# Altium schematic sheet Frequency_REF_Module.schdoc: Frequency Reference
size 420 x 297 mm; EDA_Number: ARTIQ; Projet: KASLI 3U subsystem; CheckedBy: MK; Author: G.K.; CompanyName: CREOTECH; DrawnBy: G.K.; Organization: CTI SA; Address1: Creotech Instruments SA; Address2: Okulickiego 7/9, 05-500 Poland; Revision: -; SheetNumber: -; SheetTotal: -; ModifiedBy: -; CreateDate: XX/XX/XXXX; CheckedDate: -; Title2: Top; DivGrp: CTI; Designer: G.K.; ModifiedDate: -; ProjectName: FMC DAC 100M 14B 16CHA ADC 2M 14B 4CHA
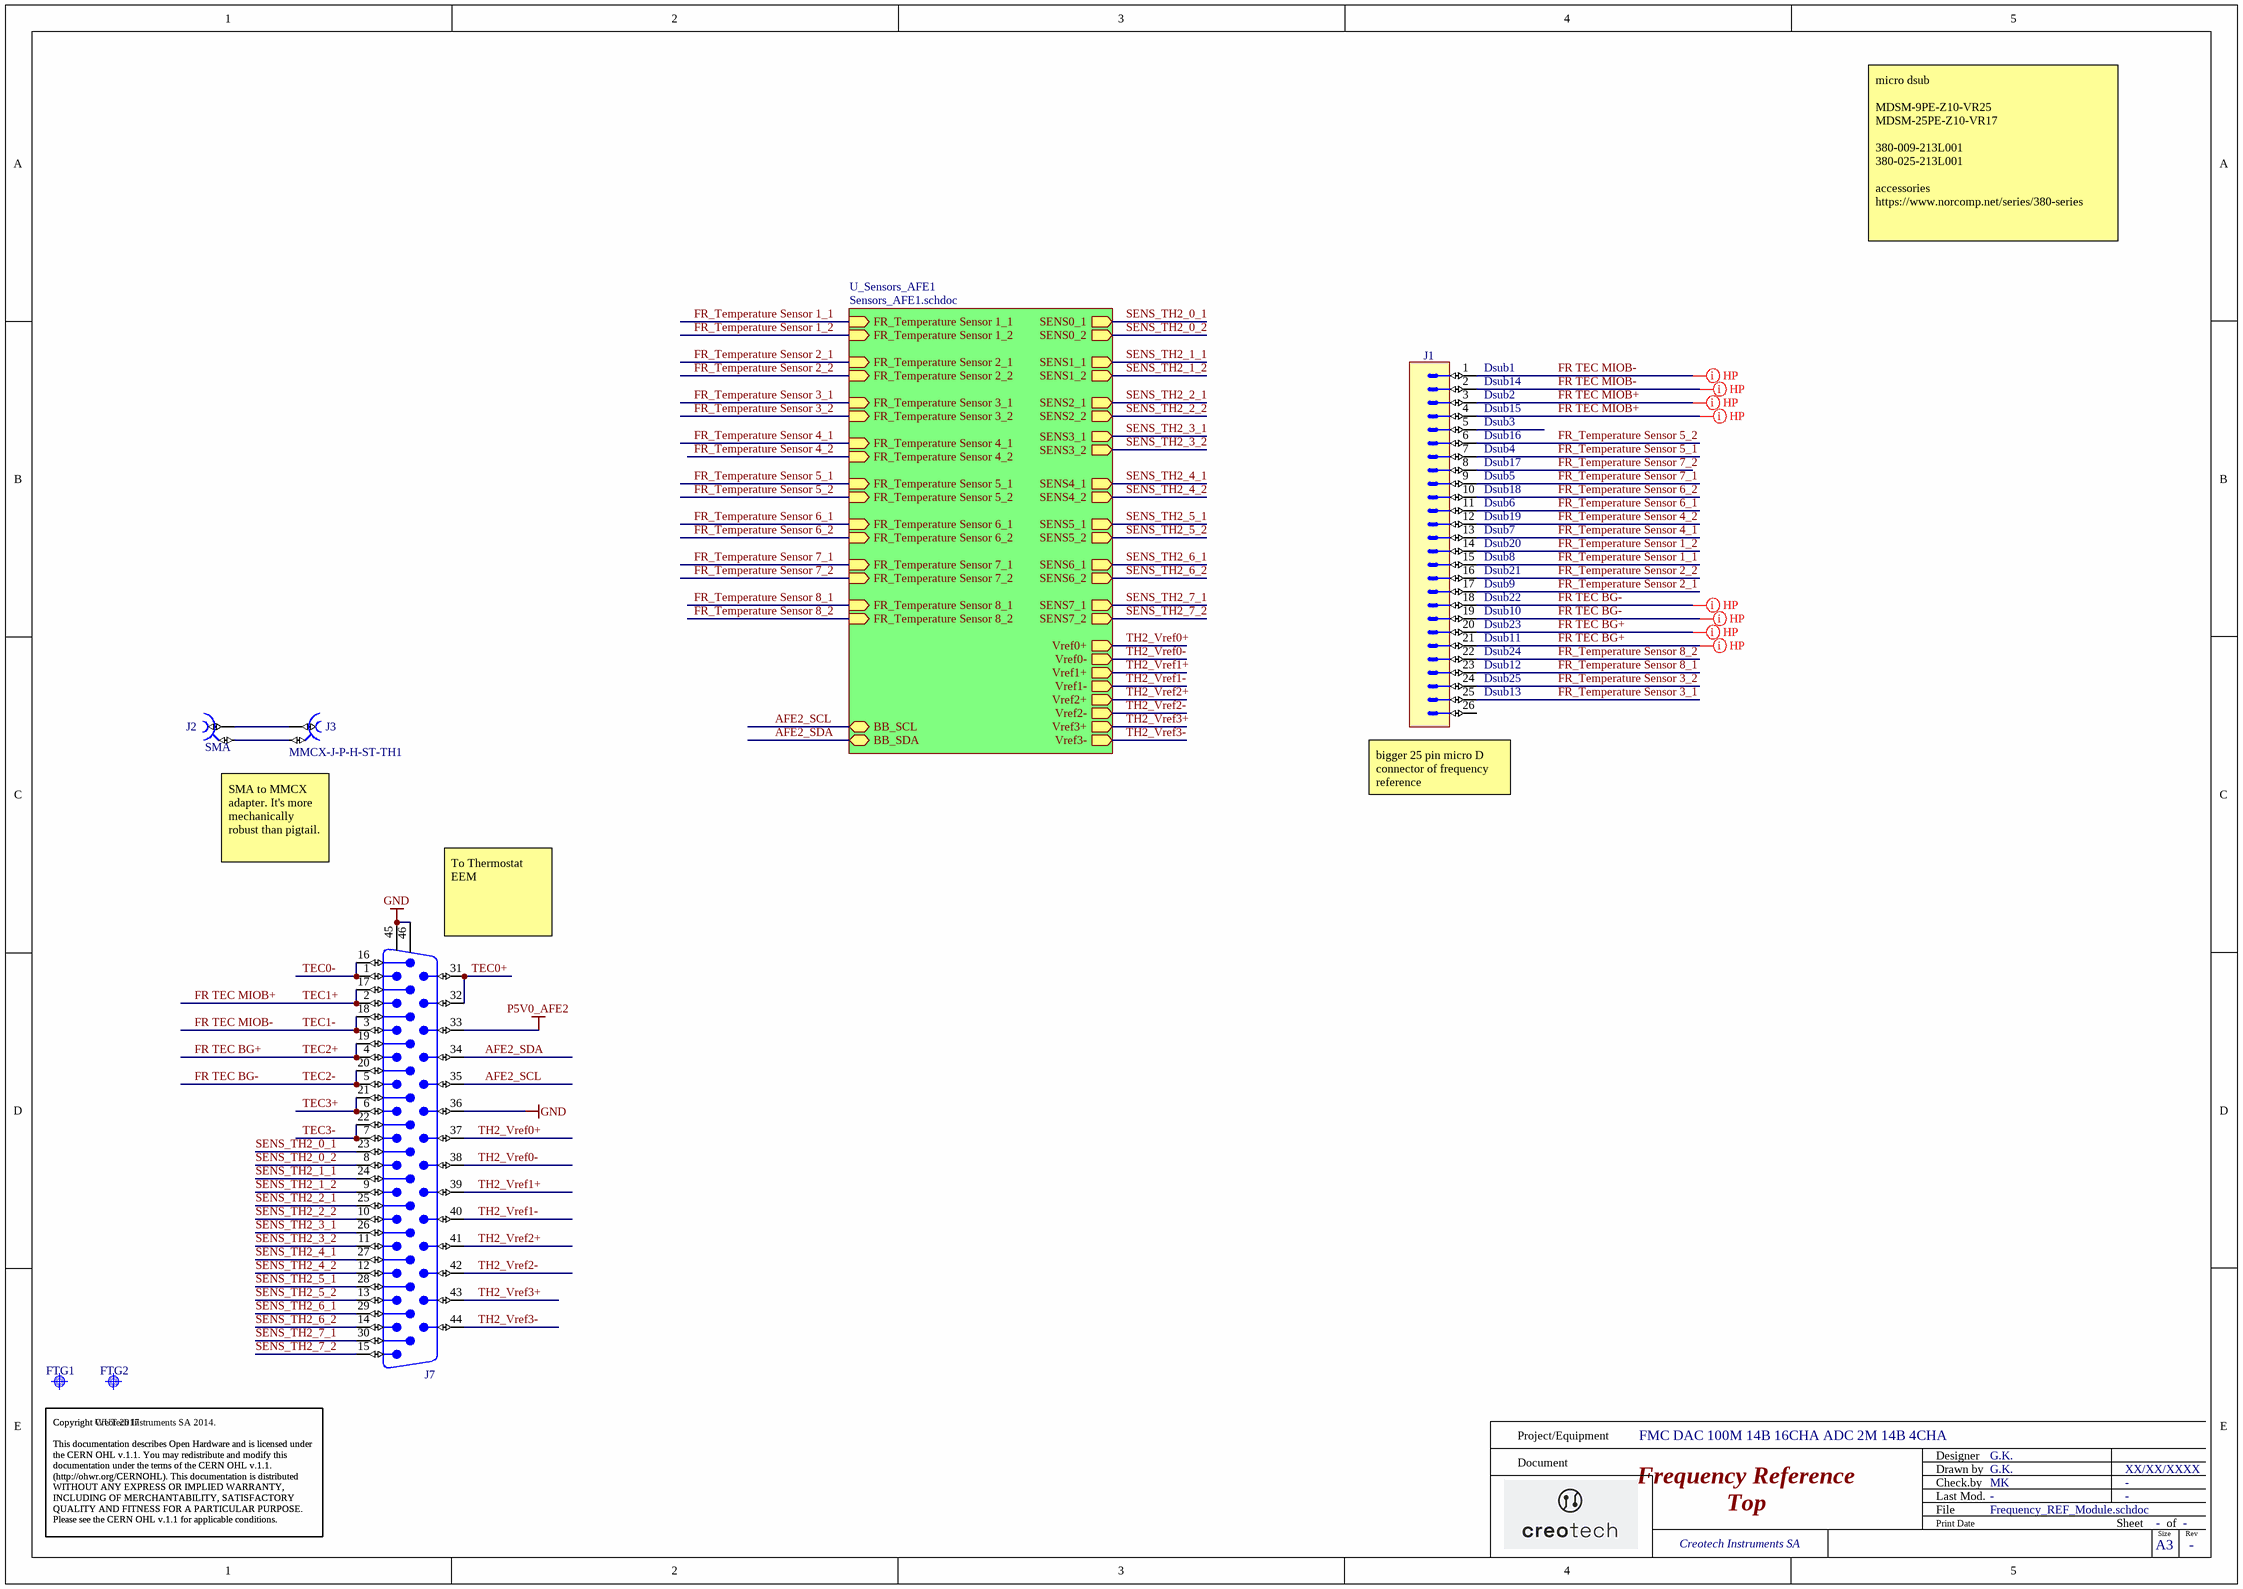
[diagram p0: Frequency_REF_Module.schdoc]

## Parts
FTG1  Use only in PCB  [FIDUCIAL_TOP_C100-200]  (value not drawn)
FTG2  Use only in PCB  [FIDUCIAL_TOP_S100-200]  (value not drawn)
J1  Header 26  [3M_N2526-6002RB]  (value not drawn)
J2  SMA  [DELOCK_65848]
J3  Manufacturer Part Number: MMCX-J-P-H-ST-TH1  [SAMTEC_MMCX-J-P-H-ST-TH1]  (hidden comment: Coax_1Female_1Shield)
J7  D-Sub  [AMPHENOL_10090926-P444XLF]  (value not drawn)

## Sub-sheets
U_Sensors_AFE1 = Sensors_AFE1.schdoc: SENS0_1 (out), SENS0_2 (out), SENS1_1 (out), SENS1_2 (out), SENS2_1 (out), SENS2_2 (out), SENS3_1 (out), SENS3_2 (out), SENS4_1 (out), SENS4_2 (out), SENS5_1 (out), SENS5_2 (out), SENS6_1 (out), SENS6_2 (out), SENS7_1 (out), SENS7_2 (out), Vref0+ (out), Vref0- (out), Vref1+ (out), Vref1- (out), Vref2+ (out), Vref2- (out), Vref3+ (out), Vref3- (out), BB_SCL (bidir), BB_SDA (bidir), FR_Temperature Sensor 1_2 (in), FR_Temperature Sensor 2_2 (in), FR_Temperature Sensor 1_1 (in), FR_Temperature Sensor 2_1 (in), FR_Temperature Sensor 3_1 (in), FR_Temperature Sensor 3_2 (in), FR_Temperature Sensor 4_1 (in), FR_Temperature Sensor 4_2 (in), FR_Temperature Sensor 5_1 (in), FR_Temperature Sensor 5_2 (in), FR_Temperature Sensor 6_1 (in), FR_Temperature Sensor 6_2 (in), FR_Temperature Sensor 7_1 (in), FR_Temperature Sensor 7_2 (in), FR_Temperature Sensor 8_1 (in), FR_Temperature Sensor 8_2 (in)

## Nets
GND: J7.36 J7.45 J7.46
P5V0_AFE2: J7.33
AFE2_SCL: J7.35 ; sheet U_Sensors_AFE1/BB_SCL
AFE2_SDA: J7.34 ; sheet U_Sensors_AFE1/BB_SDA
FR TEC BG+: J1.20 J1.21 J7.4 J7.19  [also labelled TEC2+]
FR TEC BG-: J1.18 J1.19 J7.5 J7.20  [also labelled TEC2-]
FR TEC MIOB+: J1.3 J1.4 J7.2 J7.17  [also labelled TEC1+]
FR TEC MIOB-: J1.1 J1.2 J7.3 J7.18  [also labelled TEC1-]
FR_Temperature Sensor 1_1: J1.15 ; sheet U_Sensors_AFE1/FR_Temperature Sensor 1_1
FR_Temperature Sensor 1_2: J1.14 ; sheet U_Sensors_AFE1/FR_Temperature Sensor 1_2
FR_Temperature Sensor 2_1: J1.17 ; sheet U_Sensors_AFE1/FR_Temperature Sensor 2_1
FR_Temperature Sensor 2_2: J1.16 ; sheet U_Sensors_AFE1/FR_Temperature Sensor 2_2
FR_Temperature Sensor 3_1: J1.25 ; sheet U_Sensors_AFE1/FR_Temperature Sensor 3_1
FR_Temperature Sensor 3_2: J1.24 ; sheet U_Sensors_AFE1/FR_Temperature Sensor 3_2
FR_Temperature Sensor 4_1: J1.13 ; sheet U_Sensors_AFE1/FR_Temperature Sensor 4_1
FR_Temperature Sensor 4_2: J1.12 ; sheet U_Sensors_AFE1/FR_Temperature Sensor 4_2
FR_Temperature Sensor 5_1: J1.7 ; sheet U_Sensors_AFE1/FR_Temperature Sensor 5_1
FR_Temperature Sensor 5_2: J1.6 ; sheet U_Sensors_AFE1/FR_Temperature Sensor 5_2
FR_Temperature Sensor 6_1: J1.11 ; sheet U_Sensors_AFE1/FR_Temperature Sensor 6_1
FR_Temperature Sensor 6_2: J1.10 ; sheet U_Sensors_AFE1/FR_Temperature Sensor 6_2
FR_Temperature Sensor 7_1: J1.9 ; sheet U_Sensors_AFE1/FR_Temperature Sensor 7_1
FR_Temperature Sensor 7_2: J1.8 ; sheet U_Sensors_AFE1/FR_Temperature Sensor 7_2
FR_Temperature Sensor 8_1: J1.23 ; sheet U_Sensors_AFE1/FR_Temperature Sensor 8_1
FR_Temperature Sensor 8_2: J1.22 ; sheet U_Sensors_AFE1/FR_Temperature Sensor 8_2
SENS_TH2_0_1: J7.23 ; sheet U_Sensors_AFE1/SENS0_1
SENS_TH2_0_2: J7.8 ; sheet U_Sensors_AFE1/SENS0_2
SENS_TH2_1_1: J7.24 ; sheet U_Sensors_AFE1/SENS1_1
SENS_TH2_1_2: J7.9 ; sheet U_Sensors_AFE1/SENS1_2
SENS_TH2_2_1: J7.25 ; sheet U_Sensors_AFE1/SENS2_1
SENS_TH2_2_2: J7.10 ; sheet U_Sensors_AFE1/SENS2_2
SENS_TH2_3_1: J7.26 ; sheet U_Sensors_AFE1/SENS3_1
SENS_TH2_3_2: J7.11 ; sheet U_Sensors_AFE1/SENS3_2
SENS_TH2_4_1: J7.27 ; sheet U_Sensors_AFE1/SENS4_1
SENS_TH2_4_2: J7.12 ; sheet U_Sensors_AFE1/SENS4_2
SENS_TH2_5_1: J7.28 ; sheet U_Sensors_AFE1/SENS5_1
SENS_TH2_5_2: J7.13 ; sheet U_Sensors_AFE1/SENS5_2
SENS_TH2_6_1: J7.29 ; sheet U_Sensors_AFE1/SENS6_1
SENS_TH2_6_2: J7.14 ; sheet U_Sensors_AFE1/SENS6_2
SENS_TH2_7_1: J7.30 ; sheet U_Sensors_AFE1/SENS7_1
SENS_TH2_7_2: J7.15 ; sheet U_Sensors_AFE1/SENS7_2
TEC0+: J7.31 J7.32
TEC0-: J7.1 J7.16
TEC3+: J7.6 J7.21
TEC3-: J7.7 J7.22
TH2_Vref0+: J7.37 ; sheet U_Sensors_AFE1/Vref0+
TH2_Vref0-: J7.38 ; sheet U_Sensors_AFE1/Vref0-
TH2_Vref1+: J7.39 ; sheet U_Sensors_AFE1/Vref1+
TH2_Vref1-: J7.40 ; sheet U_Sensors_AFE1/Vref1-
TH2_Vref2+: J7.41 ; sheet U_Sensors_AFE1/Vref2+
TH2_Vref2-: J7.42 ; sheet U_Sensors_AFE1/Vref2-
TH2_Vref3+: J7.43 ; sheet U_Sensors_AFE1/Vref3+
TH2_Vref3-: J7.44 ; sheet U_Sensors_AFE1/Vref3-
NetJ2_1: J2.1 J3.1
NetJ2_2: J2.2 J3.2

Not connected (* = marked no-connect by the designer): J1 5 26

## Layout directives
net class HP: FR TEC BG+, FR TEC BG-, FR TEC MIOB+, FR TEC MIOB-

## Notes on the sheet
- micro dsub
  MDSM-9PE-Z10-VR25
  MDSM-25PE-Z10-VR17
  380-009-213L001
  380-025-213L001
  accessories
  https://www.norcomp.net/series/380-series
- (near J1) Dsub1
- (near J1) Dsub2
- (near J1) Dsub14
- (near J1) Dsub3
- (near J1) Dsub4
- (near J1) Dsub15
- (near J1) Dsub16
- (near J1) Dsub5
- (near J1) Dsub6
- (near J1) Dsub7
- (near J1) Dsub17
- (near J1) Dsub18
- (near J1) Dsub19
- (near J1) Dsub8
- (near J1) Dsub9
- (near J1) Dsub20
- (near J1) Dsub21
- (near J1) Dsub10
- (near J1) Dsub11
- (near J1) Dsub12
- (near J1) Dsub22
- (near J1) Dsub23
- (near J1) Dsub24
- (near J1) Dsub13
- (near J1) Dsub25
- (near J1) bigger 25 pin micro D connector of frequency reference
- SMA to MMCX adapter. It's more mechanically robust than pigtail.
- (near J7) To Thermostat EEM
- Copyright WUT 2017
  This documentation describes Open Hardware and is licensed under the CERN OHL v.1.1. You may redistribute and modify this documentation under the terms of the CERN OHL v.1.1. (http://ohwr.org/CERNOHL). This documentation is distributed WITHOUT ANY EXPRESS OR IMPLIED WARRANTY, INCLUDING OF MERCHANTABILITY, SATISFACTORY QUALITY AND FITNESS FOR A PARTICULAR PURPOSE. Please see the CERN OHL v.1.1 for applicable conditions.
- Project/Equipment
- Document
- Designer
- Drawn by
- Check.by
- Copyright Creotech Instruments SA 2014.
  This documentation describes Open Hardware and is licensed under the CERN OHL v.1.1. You may redistribute and modify this documentation under the terms of the CERN OHL v.1.1. (http://ohwr.org/CERNOHL). This documentation is distributed WITHOUT ANY EXPRESS OR IMPLIED WARRANTY, INCLUDING OF MERCHANTABILITY, SATISFACTORY QUALITY AND FITNESS FOR A PARTICULAR PURPOSE. Please see the CERN OHL v.1.1 for applicable conditions.
- File
- Last Mod.
- Print Date
- Sheet
- Size
- A3
- of
- Rev

## Library data of the parts
FTG1 = FIDUCIAL_TARGET_C100-200: Fiducial Target; Part Description: Round Fiducial Target, Top Layer, 1.0mm, Top Solder 2.0mm, Keepout =2.0mm; Mounted: No; Part Number: FIDUCIAL_TARGET_C100-200; Component Kind: Standard (No BOM); Component Type: Standard (No BOM); Pin Count: 1; Family: Fiducial; Socket: No; SMD: Yes; Sense: No; Status: None; ComponentHeight: 0mm; HelpURL: Undefined; Author: CERN DEM JLC; CreateDate: 09.02.2010; LatestRevisionDate: 04.04.2012; PackageDescription: Round Fiducial Target, Top Layer, 1.0mm, Top Solder 2.0mm, Keepout =2.0mm
FTG2 = FIDUCIAL_TARGET_S100-200: Fiducial Target; Part Description: Square Fiducial Target, Top Layer, 1.0mm, Top Solder 2.0mm, Keepout =2.0mm; Mounted: No; Part Number: FIDUCIAL_TARGET_S100-200; Component Kind: Standard (No BOM); Component Type: Standard (No BOM); Pin Count: 1; Family: Fiducial; Socket: No; SMD: Yes; Sense: No; Status: None; ComponentHeight: 0mm; HelpURL: Undefined; Author: CERN DEM JLC; CreateDate: 09.02.2010; LatestRevisionDate: 04.04.2012; PackageDescription: Square Fiducial Target, Top Layer, 1.0mm, Top Solder 2.0mm, Keepout =2.0mm
J1 = 3M_N2526-6002RB: Connector 26 Male; Part Description: 26 Contacts, Straight .100'' x .100'' Low Profile Four-Wall Header, 2500 Series; Manufacturer: 3M; PressFit: No; Part Number: 3M_N2526-6002RB; Component Kind: Standard; Component Type: Standard; Pin Count: 26; Family: Header 26; Mounted: Yes; Socket: No; SMD: No; Sense: No; Status: None; Manufacturer Part Number: N2526-6002RB; ComponentHeight: 10.03mm; HelpURL: \\cern.ch\dfs\Applications\Altium\Datasheets\3M_N2526-6002RB.pdf; Author: CERN DEM JLC; CreateDate: 11.02.2009; LatestRevisionDate: 11.08.2009
J2 = CON_SMA_DELOCK_65848: 50 Ohm Through Hole SMA Right Angle PCB Jack; Manufacturer: DELOCK; Manufacturer Part Number: 5848 (4043619658480); PressFit: No; Part Number: DELOCK_65848; Component Kind: Standard; Component Type: Standard; Pin Count: 5; Family: SMA; Mounted: Yes; Socket: No; SMD: No; Sense: No; Status: None; Part Description: 50 Ohm Through Hole SMA Right Angle PCB Jack; ComponentHeight: 12.5; HelpURL: \\cern.ch\dfs\Applications\Altium\Datasheets\AMPHENOL_132203-16.pdf; Author: GK; CreateDate: 13.05.2019; LatestRevisionDate: 13.05.2019
J3 = SAMTEC_MMCX-J-P-H-ST-TH1: Part Description: Straight Through-hole 50 Ohm Micro Mini RF Jack, MMCX Series; Manufacturer: SAMTEC; PressFit: No; Part Number: SAMTEC_MMCX-J-P-H-ST-TH1; Component Kind: Standard; Component Type: Standard; Pin Count: 2; Mounted: Yes; Socket: No; SMD: No; Sense: No; Status: None; ComponentHeight: 4.35mm; HelpURL: \\cern.ch\dfs\Applications\Altium\Datasheets\SAMTEC_MMCX-J-P-H-ST-TH1.pdf; Author: CERN DEM JLC; CreateDate: 05.12.2012; LatestRevisionDate: 05.12.2012
J7 = AMPHENOL_10090926-P444XLF: Connector D-sub 44 Male; Part Description: Right Angle High Density D-sub 44 Male Contacts with Harpoons + UNC 4-40 Clinchnuts + Electrical Continuity; PressFit: No; Part Number: AMPHENOL_10090926-P444XLF; Component Kind: Standard; Component Type: Standard; Pin Count: 46; Family: D-Sub; Mounted: Yes; Socket: No; SMD: No; Sense: No; Status: None; Manufacturer: AMPHENOL; Manufacturer Part Number: 10090926-P444XLF; ComponentHeight: 12.8mm; HelpURL: \\cern.ch\dfs\Applications\Altium\Datasheets\AMPHENOL_10090926-P444XLF.pdf; Author: CERN DEM BC; CreateDate: 22.10.2020; LatestRevisionDate: 22.10.2020